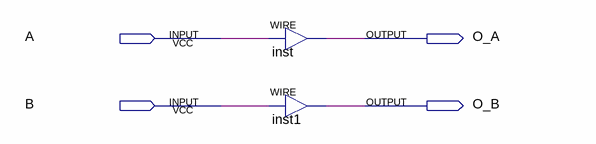
[diagram p0: schematic sheet]
// Quartus schematic tolete.bdf as structural Verilog: 2 symbols, 4 pins
module tolete (
  input  A,
  input  B,
  output O_A,
  output O_B
);

  assign O_A = A;  // WIRE inst
  assign O_B = B;  // WIRE inst1
endmodule
